# Altium schematic sheet Receptor2.SchDoc
size A3
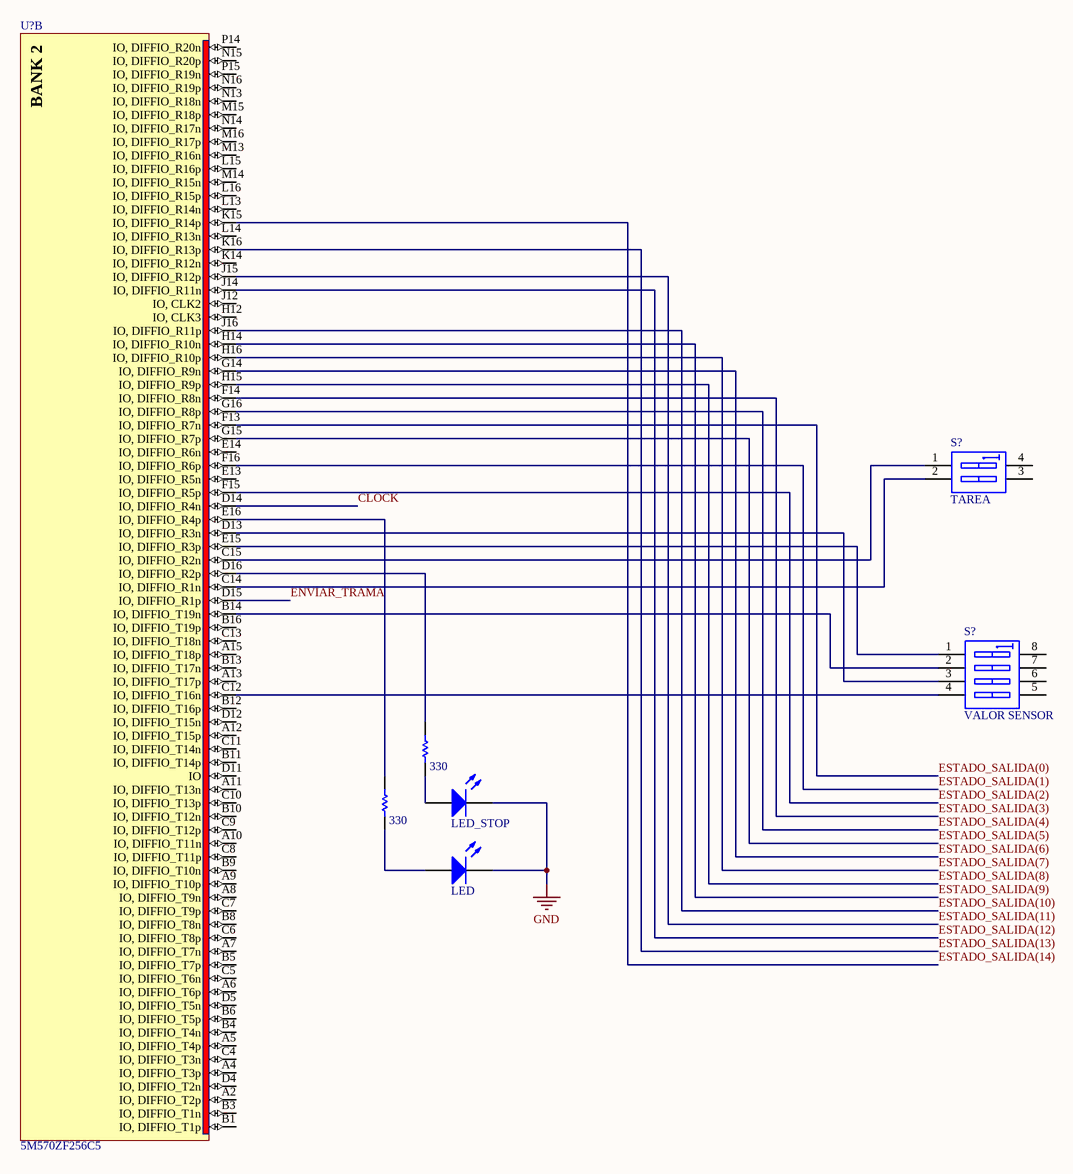
[diagram p0: Receptor2.SchDoc]

## Parts
(Parts that share a designator on the sheet are numbered #1, #2 ... from top to bottom, then left to right.)
?#1  value 330  [AXIAL-0.3]
?#2  LED_STOP  [LED-0]
?#3  value 330  [AXIAL-0.3]
?#4  LED  [LED-0]
S?#1  TAREA  [DIP-4]
S?#2  VALOR SENSOR  [SO8_N]
U?  5M570ZF256C5  [FBGA256_A-155]  (part B of 5)

## Nets
GND: ?#2.2(K) ?#4.2(K)
CLOCK: U?.D14(IO,_DIFFIO_R4n)
ENVIAR_TRAMA: U?.D15(IO,_DIFFIO_R1p)
ESTADO_SALIDA(0): U?.F13(IO,_DIFFIO_R7n)
ESTADO_SALIDA(1): U?.F16(IO,_DIFFIO_R6p)
ESTADO_SALIDA(2): U?.F15(IO,_DIFFIO_R5p)
ESTADO_SALIDA(3): U?.F14(IO,_DIFFIO_R8n)
ESTADO_SALIDA(4): U?.G16(IO,_DIFFIO_R8p)
ESTADO_SALIDA(5): U?.G15(IO,_DIFFIO_R7p)
ESTADO_SALIDA(6): U?.G14(IO,_DIFFIO_R9n)
ESTADO_SALIDA(7): U?.H16(IO,_DIFFIO_R10p)
ESTADO_SALIDA(8): U?.H15(IO,_DIFFIO_R9p)
ESTADO_SALIDA(9): U?.H14(IO,_DIFFIO_R10n)
ESTADO_SALIDA(10): U?.J16(IO,_DIFFIO_R11p)
ESTADO_SALIDA(11): U?.J15(IO,_DIFFIO_R12p)
ESTADO_SALIDA(12): U?.J14(IO,_DIFFIO_R11n)
ESTADO_SALIDA(13): U?.K16(IO,_DIFFIO_R13p)
ESTADO_SALIDA(14): U?.K15(IO,_DIFFIO_R14p)
Net?#1_1: ?#1.1 ?#2.1(A)
Net?#1_2: ?#1.2 U?.D16(IO,_DIFFIO_R2p)
Net?#3_1: ?#3.1 ?#4.1(A)
Net?#3_2: ?#3.2 U?.E16(IO,_DIFFIO_R4p)
NetS?#1_1: S?#1.1(A1) U?.C15(IO,_DIFFIO_R2n)
NetS?#1_2: S?#1.2(A2) U?.C14(IO,_DIFFIO_R1n)
NetS?#2_1: S?#2.1(A1) U?.E15(IO,_DIFFIO_R3p)
NetS?#2_2: S?#2.2(A2) U?.B14(IO,_DIFFIO_T19n)
NetS?#2_3: S?#2.3(A3) U?.D13(IO,_DIFFIO_R3n)
NetS?#2_4: S?#2.4(A4) U?.C12(IO,_DIFFIO_T16n)

Not connected (* = marked no-connect by the designer): S?#1 3(B2) 4(B1); S?#2 5(B4) 6(B3) 7(B2) 8(B1); U? A2(IO,_DIFFIO_T2p) A4(IO,_DIFFIO_T3p) A5(IO,_DIFFIO_T4p) A6(IO,_DIFFIO_T6p) A7(IO,_DIFFIO_T7n) A8(IO,_DIFFIO_T9n) A9(IO,_DIFFIO_T10p) A10(IO,_DIFFIO_T11n) A11(IO,_DIFFIO_T13n) A12(IO,_DIFFIO_T15p) A13(IO,_DIFFIO_T17p) A15(IO,_DIFFIO_T18p) B1(IO,_DIFFIO_T1p) B3(IO,_DIFFIO_T1n) B4(IO,_DIFFIO_T4n) B5(IO,_DIFFIO_T7p) B6(IO,_DIFFIO_T5p) B8(IO,_DIFFIO_T8n) B9(IO,_DIFFIO_T10n) B10(IO,_DIFFIO_T12n) B11(IO,_DIFFIO_T14p) B12(IO,_DIFFIO_T16p) B13(IO,_DIFFIO_T17n) B16(IO,_DIFFIO_T19p) C4(IO,_DIFFIO_T3n) C5(IO,_DIFFIO_T6n) C6(IO,_DIFFIO_T8p) C7(IO,_DIFFIO_T9p) C8(IO,_DIFFIO_T11p) C9(IO,_DIFFIO_T12p) C10(IO,_DIFFIO_T13p) C11(IO,_DIFFIO_T14n) C13(IO,_DIFFIO_T18n) D4(IO,_DIFFIO_T2n) D5(IO,_DIFFIO_T5n) D11(IO) D12(IO,_DIFFIO_T15n) E13(IO,_DIFFIO_R5n) E14(IO,_DIFFIO_R6n) H12(IO,_CLK3) J12(IO,_CLK2) K14(IO,_DIFFIO_R12n) L13(IO,_DIFFIO_R14n) L14(IO,_DIFFIO_R13n) L15(IO,_DIFFIO_R16p) L16(IO,_DIFFIO_R15p) M13(IO,_DIFFIO_R16n) M14(IO,_DIFFIO_R15n) M15(IO,_DIFFIO_R18p) M16(IO,_DIFFIO_R17p) N13(IO,_DIFFIO_R18n) N14(IO,_DIFFIO_R17n) N15(IO,_DIFFIO_R20p) N16(IO,_DIFFIO_R19p) P14(IO,_DIFFIO_R20n) P15(IO,_DIFFIO_R19n)

## Notes on the sheet
- (in symbol 5M570ZF256C5, part B) BANK 2

## Library data of the parts
?#1 ?#3 = Res1: Resistor; Published: 8-Jun-2000; LatestRevisionDate: 17-Jul-2002; LatestRevisionNote: Re-released for DXP Platform.; PackageReference: AXIAL-0.3; Publisher: Altium Limited; PackageDescription: Axial Device, Thru-Hole; 2 Leads; 0.3 in Pin Spacing
?#2 ?#4 = LED0: Typical INFRARED GaAs LED; Published: 8-Jun-2000; LatestRevisionDate: 08-Jul-2005; LatestRevisionNote: Mech Layer 1 removed.; PackageReference: LED-0; Publisher: Altium Limited; PackageDescription: LED; 2 Leads
S?#1 = SW DIP-2: DIP Switch, 2 Position, SPST; Published: 24-Mar-1999; LatestRevisionDate: 17-Jul-2002; LatestRevisionNote: Re-released for DXP Platform.; PackageReference: DIP-4; Publisher: Altium Limited
S?#2 = SW DIP-4: DIP Switch, 4 Position, SPST; Published: 24-Mar-1999; LatestRevisionDate: 29-May-2009; LatestRevisionNote: IPC-7351 Footprint Added.; PackageVersion: Dec-2002; PackageReference: SO8; Publisher: Altium Limited; PackageDescription: 8-Pin Small Outline Integrated Circuit 1.27 mm Pitch; Code_JEDEC: MS-012-AA; Code_IPC: SOIC127P600-8
U? = 5M570ZF256C5: MAX V 1.8V CPLD, 159 IOs, 570 Logic Elements, 256-Pin FBGA, Commercial Temperature, Speed Grade 5; DatasheetVersion: ver1.2, May-2011; PackageVersion: ver2.0, Nov-2011; PackageReference: FBGA256_A-155; PackageDescription: 256-Pin FineLine Ball-Grid Array (FBGA) - Thin - Wire Bond - A:1.55; Code_JEDEC: MO-192-DAF-1; ComponentLink1Description: Manufacturer URL; ComponentLink1URL: http://www.altera.com/; ComponentLink2Description: Datasheet; ComponentLink2URL: http://www.altera.com/literature/hb/max-v/max5_handbook.pdf; ComponentLink3Description: MAX V Device Pin-Out files; ComponentLink3URL: http://www.altera.com/literature/lit-dp.jsp?category=MAX%205&showspreadsheet=y; ComponentLink4Description: Package Specification; ComponentLink4URL: http://www.altera.com/devicepackaging/04R-00230_03.pdf